# EAGLE board EMC02 (EAGLE 7.2.0)
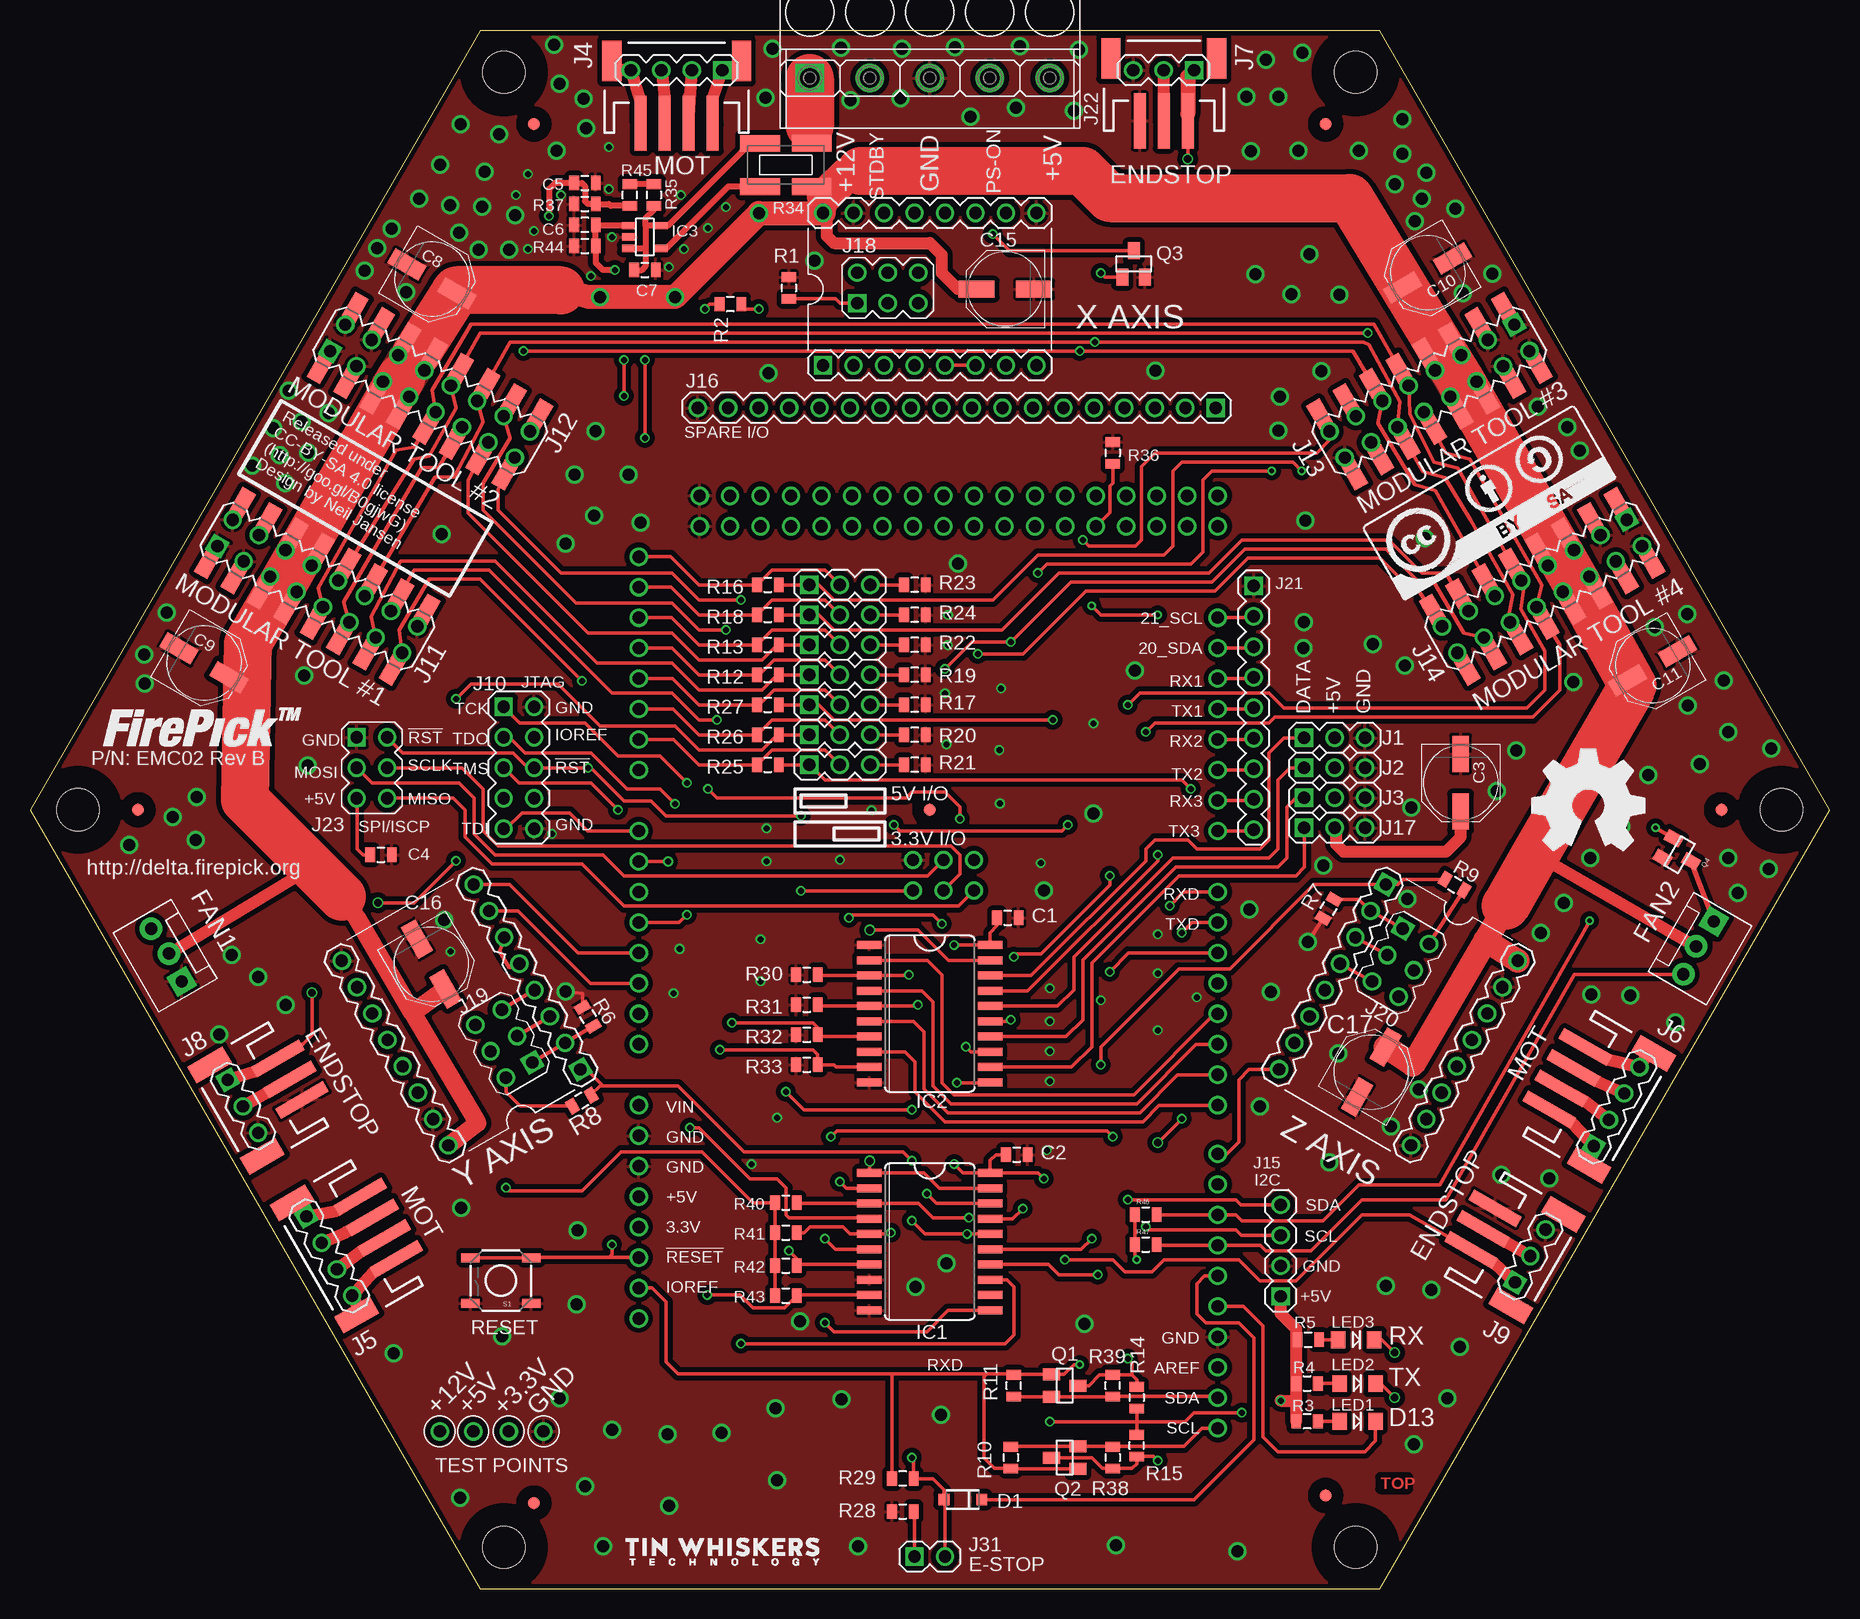
[diagram p2: board, top side]
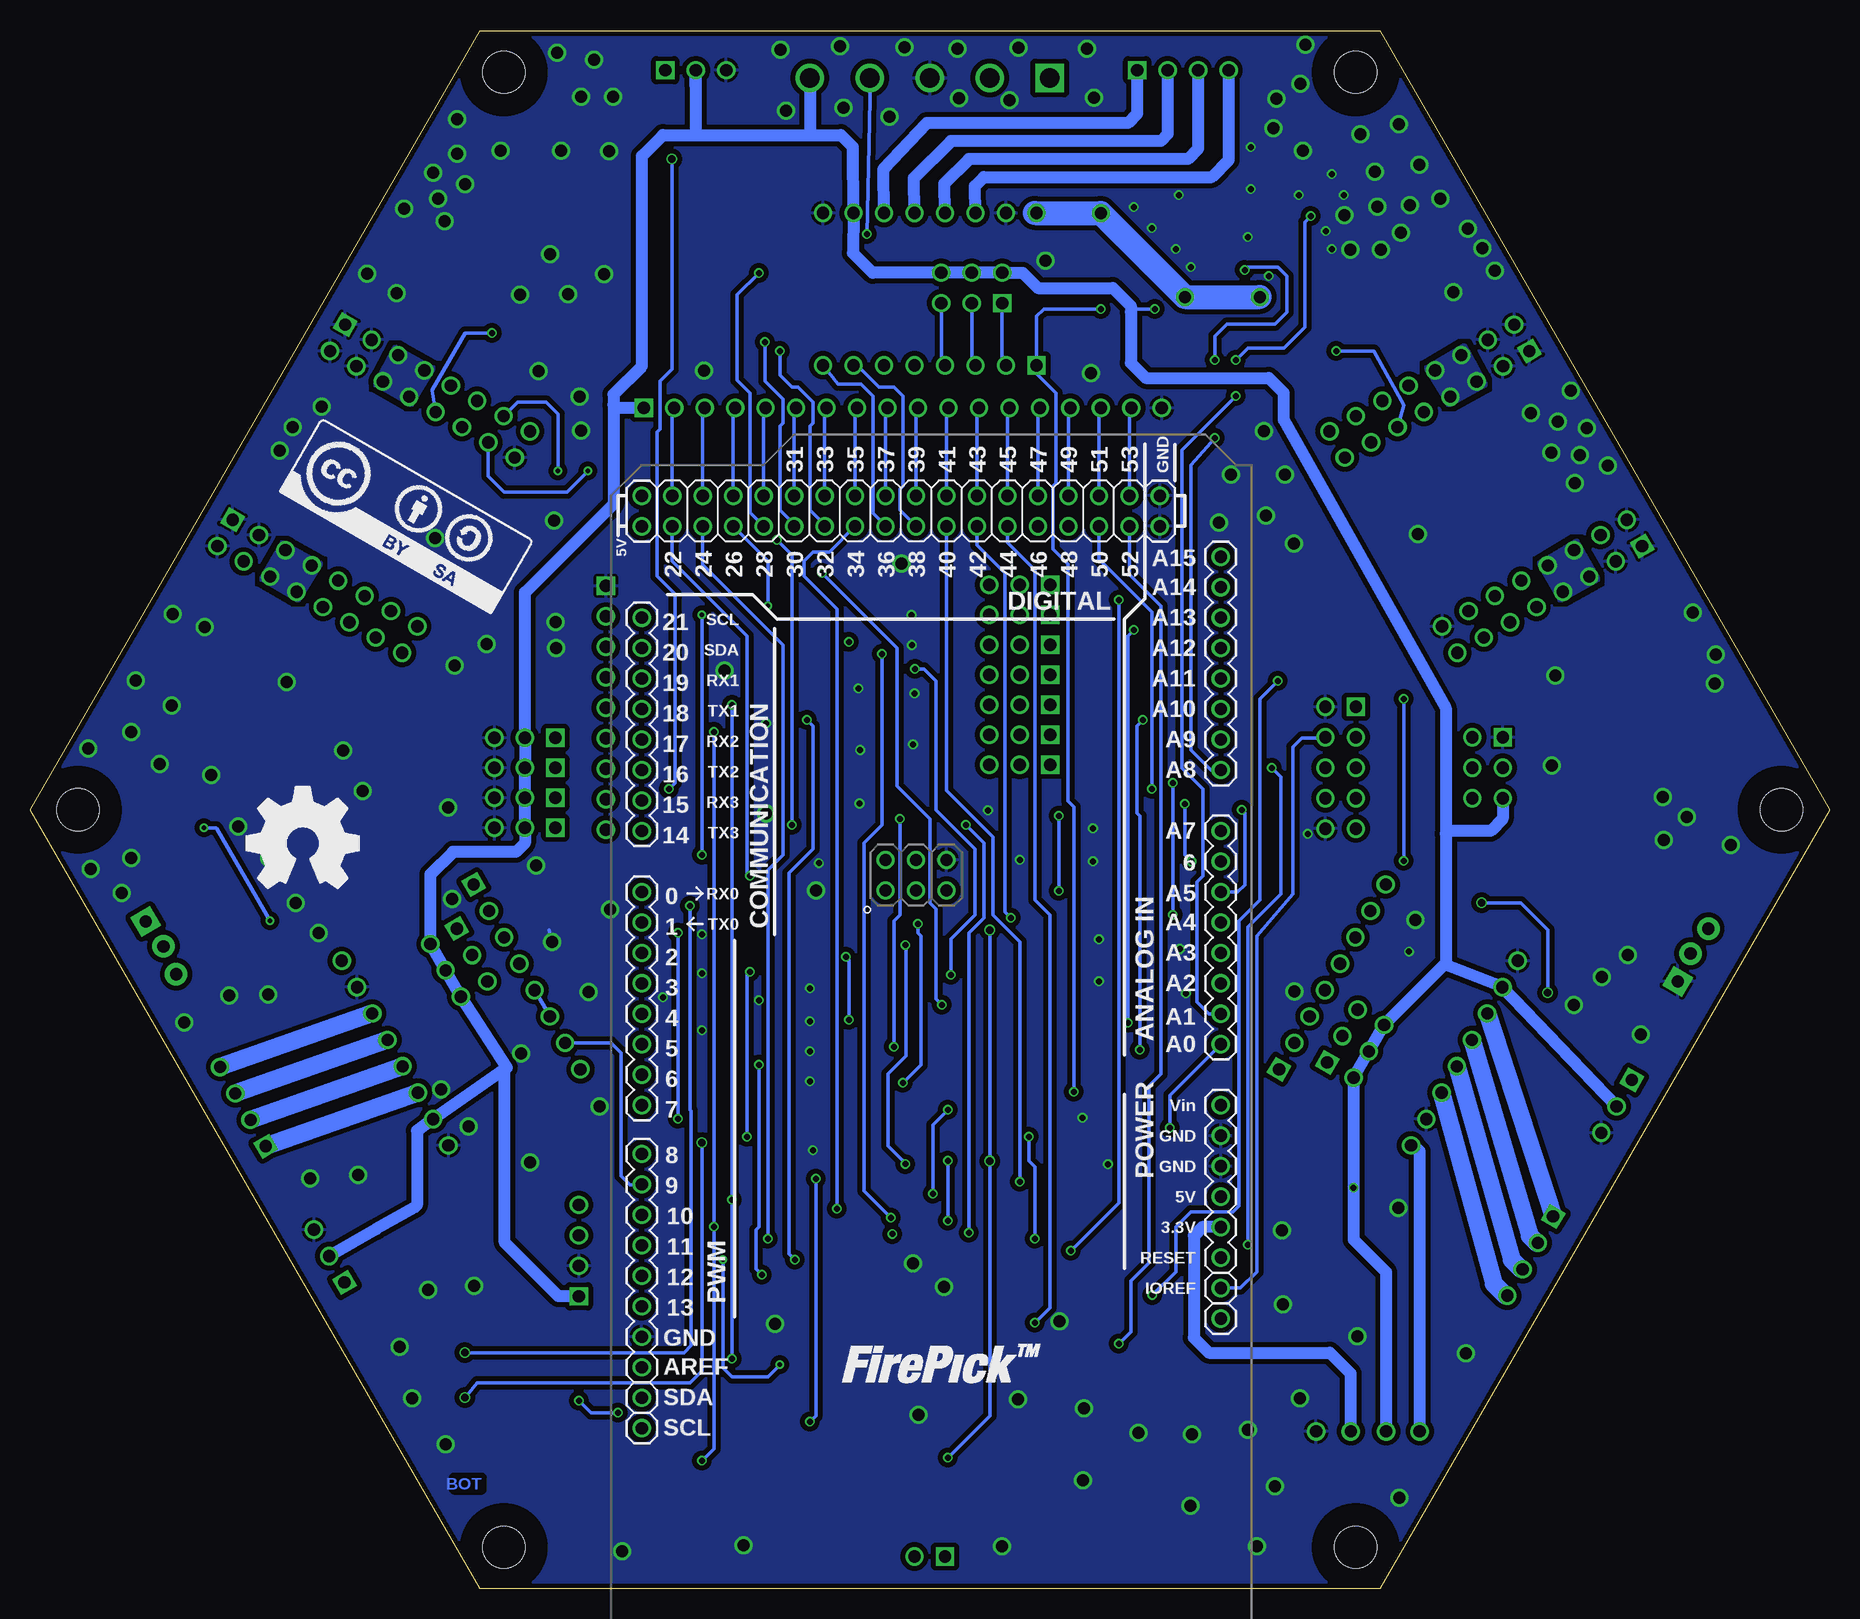
[diagram p3: board, bottom side, seen from below]

Size 150 x 129.9 mm. Coordinates in mm from the lower left corner, seen from the top.
Outline: 37.5,0 112.5,0 150,64.95 112.5,129.9 37.5,129.9 0,64.95 37.5,0
Copper layers (1*16): Top 0.035mm / dielectric 1.5mm / Bottom 0.035mm
Design rules "SeeedStudio_2layer_DRU_no_angle_20140221": minimum track width 6mil, minimum drill 12mil, track to track 6mil, track to pad 6mil, pad to pad 6mil, via to via 6mil, smd to smd 0mil, copper to edge 10mil, drill to drill 10mil, minimum pad ring 10mil, minimum via ring 6mil, stop-mask expansion 2mil, vias tented up to drill 100mil, thermal gap 10mil
Net classes: 0 default: width 0.152 mm, drill 0.305 mm, clearance 0.152 mm
Holes 3.5 mm at 4,64.95 39.5,3.46 110.5,3.46 146,64.95 39.5,126.44 110.5,126.44
tRestrict: area 142.8,61.7 to 149.2,68.2; area 0.8,61.7 to 7.2,68.2; area 107.2,0.2 to 113.8,6.7; area 36.2,123.2 to 42.8,129.7; area 107.2,123.2 to 113.8,129.7; area 36.2,0.2 to 42.8,6.7
bRestrict: area 0.8,61.7 to 7.2,68.2; area 107.2,123.2 to 113.8,129.7; area 142.8,61.7 to 149.2,68.2; area 36.2,0.2 to 42.8,6.7; area 107.2,0.2 to 113.8,6.7; area 36.2,123.2 to 42.8,129.7

## Footprints (pad centres in the part's own frame; a part is rotated, then mirrored left to right if it is on the bottom)
ARDUINO-MEGA = drill 1.016: 0 63.5,50.8; 1 60.96,50.8; 2 58.42,50.8; 3 55.88,50.8; 3.3V 35.56,2.54; 4 53.34,50.8; 5 50.8,50.8; 5V@0 38.1,2.54; 5V@1 93.98,50.8; 5V@2 96.52,50.8; 6 48.26,50.8; 7 45.72,50.8; 8 41.656,50.8; 9 39.116,50.8; 10 36.576,50.8; 11 34.036,50.8; 12 31.496,50.8; 13 28.956,50.8; 14 68.58,50.8; 15 71.12,50.8; 16 73.66,50.8; 17 76.2,50.8; 18 78.74,50.8; 19 81.28,50.8; 20 83.82,50.8; 21 86.36,50.8; 22 93.98,48.26; 23 96.52,48.26; 24 93.98,45.72; 25 96.52,45.72; 26 93.98,43.18; 27 96.52,43.18; 28 93.98,40.64; 29 96.52,40.64; 30 93.98,38.1; 31 96.52,38.1; 32 93.98,35.56; 33 96.52,35.56; 34 93.98,33.02; 35 96.52,33.02; 36 93.98,30.48; 37 96.52,30.48; 38 93.98,27.94; 39 96.52,27.94; 40 93.98,25.4; 41 96.52,25.4; 42 93.98,22.86; 43 96.52,22.86; 44 93.98,20.32; 45 96.52,20.32; 46 93.98,17.78; 47 96.52,17.78; 48 93.98,15.24; 49 96.52,15.24; 50 93.98,12.7; 51 96.52,12.7; 52 93.98,10.16; 53 96.52,10.16; A0 50.8,2.54; A1 53.34,2.54; A2 55.88,2.54; A3 58.42,2.54; A4 60.96,2.54; A5 63.5,2.54; A6 66.04,2.54; A7 68.58,2.54; A8 73.66,2.54; A9 76.2,2.54; A10 78.74,2.54; A11 81.28,2.54; A12 83.82,2.54; A13 86.36,2.54; A14 88.9,2.54; A15 91.44,2.54; AREF 23.876,50.8; GND@0 40.64,2.54; GND@1 43.18,2.54; GND@2 93.98,7.62; GND@3 96.52,7.62; GND@4 26.416,50.8; ICSP-GND 66.167,25.4; ICSP-MISO 63.627,30.48; ICSP-MOSI 66.167,27.94; ICSP-RESET 63.627,25.4; ICSP-SCK 63.627,27.94; IOREF 30.48,2.54; ISCP-+5V 66.167,30.48; N/A 27.94,2.54; RESET 33.02,2.54; SCL 18.796,50.8; SDA 21.336,50.8; VIN 45.72,2.54
0805 = smd 0.8 x 1.2: 1 -0.9,0; 2 0.9,0
PANASONIC_D = smd 3 x 1.4: + 2.4,0; - -2.4,0
SOD-123 = smd 0.9 x 0.95: A 1.575,0; C -1.575,0
MOLEX-1X3_LOCK = drill 1.016 pad 1.88 square: 1 0,0.127 | drill 1.016 pad 1.88: 2 2.54,-0.127; 3 5.08,0.127
FIDUCIAL = smd 1 x 1: 1 0,0
SO20W = smd 0.66 x 2.032: 1 -5.715,-5.029; 2 -4.445,-5.029; 3 -3.175,-5.029; 4 -1.905,-5.029; 5 -0.635,-5.029; 6 0.635,-5.029; 7 1.905,-5.029; 8 3.175,-5.029; 9 4.445,-5.029; 10 5.715,-5.029; 11 5.715,5.029; 12 4.445,5.029; 13 3.175,5.029; 14 1.905,5.029; 15 0.635,5.029; 16 -0.635,5.029; 17 -1.905,5.029; 18 -3.175,5.029; 19 -4.445,5.029; 20 -5.715,5.029
SOT23-5 = smd 0.6 x 1.2: 1 -0.95,-1.306; 2 0,-1.306; 3 0.95,-1.306; 4 0.95,1.306; 5 -0.95,1.306
MA03-1 = drill 1.016 square: 1 -2.54,0 | drill 1.016: 2 0,0; 3 2.54,0
MA04-1 = drill 1.016 square: 1 -3.81,0 | drill 1.016: 2 -1.27,0; 3 1.27,0; 4 3.81,0
CONN-JST-PH_2.0MM_4PIN-SMT-RA = smd 1 x 4.6: 1 3,-2.43; 2 1,-2.43; 3 -1,-2.43; 4 -3,-2.43 | smd 1.6 x 3.4: NC1 -5.4,2.77; NC2 5.4,2.77
CONN-JST_PH-2.0MM-3PIN-SMT-RA = smd 1 x 4.6: 1 2.01,-2.23; 2 0.01,-2.23; 3 -1.99,-2.23 | smd 1.6 x 3.4: NC1 -4.39,2.97; NC2 4.41,2.97
MA05-2 = drill 1.016 square: 1 -5.08,-1.27 | drill 1.016: 2 -5.08,1.27; 3 -2.54,-1.27; 4 -2.54,1.27; 5 0,-1.27; 6 0,1.27; 7 2.54,-1.27; 8 2.54,1.27; 9 5.08,-1.27; 10 5.08,1.27
CONN-RECT-2.54MM-16PIN-2ROW-SMTH = drill 1.016 square: 1 -8.89,-1.27 | drill 1.016: 2 -8.89,1.27; 3 -6.35,-1.27; 4 -6.35,1.27; 5 -3.81,-1.27; 6 -3.81,1.27; 7 -1.27,-1.27; 8 -1.27,1.27; 9 1.27,-1.27; 10 1.27,1.27; 11 3.81,-1.27; 12 3.81,1.27; 13 6.35,-1.27; 14 6.35,1.27; 15 8.89,-1.27; 16 8.89,1.27 | smd 1.27 x 2.3: P1 -8.89,-2.93; P2 -8.89,2.93; P3 -6.35,-2.93; P4 -6.35,2.93; P5 -3.81,-2.93; P6 -3.81,2.93; P7 -1.27,-2.93; P8 -1.27,2.93; P9 1.27,-2.93; P10 1.27,2.93; P11 3.81,-2.93; P12 3.81,2.93; P13 6.35,-2.93; P14 6.35,2.93; P15 8.89,-2.93; P16 8.89,2.93
MA18-1 = drill 1.016 square: 1 -21.59,0 | drill 1.016: 2 -19.05,0; 3 -16.51,0; 4 -13.97,0; 5 -11.43,0; 6 -8.89,0; 7 -6.35,0; 8 -3.81,0; 9 -1.27,0; 10 1.27,0; 11 3.81,0; 12 6.35,0; 13 8.89,0; 14 11.43,0; 15 13.97,0; 16 16.51,0; 17 19.05,0; 18 21.59,0
MA03-2 = drill 1.016 square: 1 -2.54,-1.27 | drill 1.016: 2 -2.54,1.27; 3 0,-1.27; 4 0,1.27; 5 2.54,-1.27; 6 2.54,1.27
MA09-1 = drill 1.016 square: 1 -10.16,0 | drill 1.016: 2 -7.62,0; 3 -5.08,0; 4 -2.54,0; 5 0,0; 6 2.54,0; 7 5.08,0; 8 7.62,0; 9 10.16,0
CONN-OSTOP050000 = drill 1.6 square: 1 -10,0 | drill 1.6: 2 -5,0; 3 0,0; 4 5,0; 5 10,0
MA02-1 = drill 1.016 square: 1 -1.27,0 | drill 1.016: 2 1.27,0
LED-1206-NO_SILK = smd 1.2 x 1.4: A -1.5,0; C 1.5,0
SOT23 = smd 1 x 1.4: 1 -0.95,-1.1; 2 0.95,-1.1; 3 0,1.1
CHIP-1224-KELVIN = smd 1.4 x 3.3: I1 -1.8,-2.15; I2 1.8,-2.15; V1 -1.8,2.15; V2 1.8,2.15
TACTILE_SWITCH_SMD = smd 1.524 x 0.762: 1 -2.54,1.905; 2 2.54,1.905; 3 -2.54,-1.905; 4 2.54,-1.905
STEPSTICK = drill 1.016: 1A 6.35,-1.27; 1B 6.35,-3.81; 2A 6.35,1.27; 2B 6.35,3.81; !RESET! -6.35,-1.27; !SLEEP! -6.35,-3.81; DIR -6.35,-8.89; GND 6.35,6.35; GND@2 6.35,-8.89; MS1 -6.35,6.35; MS2 -6.35,3.81; MS3 -6.35,1.27; STEP -6.35,-6.35; VDD 6.35,-6.35; VMOT 6.35,8.89 | drill 1.016 square: !ENABLE! -6.35,8.89
CON-TESTPOINT = drill 1.016: 1 0,0

## Placement (x,y rotation side)
ARDUINO  ARDUINO-MEGA  [ARDUINO-MEGA]  48.2,-5.4 90 bottom
C1  0.1u  [0805]  81.5,55.95 0 top
C2  0.1u  [0805]  82.25,36.2 0 top
C3  100uF  [PANASONIC_D]  119.25,67.2 270 top
C4  0.1u  [0805]  29.25,61.2 0 top
C5  0.1u  [0805]  46.25,117.2 0 top
C6  0.1u  [0805]  46.25,113.7 180 top
C7  0.1u  [0805]  51.25,109.95 0 top
C8  100uF  [PANASONIC_D]  33.5,109.2 330 top
C9  100uF  [PANASONIC_D]  14.5,77.2 330 top
C10  100uF  [PANASONIC_D]  116.5,109.7 210 top
C11  100uF  [PANASONIC_D]  135.25,76.95 210 top
C15  100uF  [PANASONIC_D]  81.3,108.35 180 top
C16  100uF  [PANASONIC_D]  33.44,52.09 300 top
C17  100uF  [PANASONIC_D]  111.81,43.09 60 top
D1  1N4148  [SOD-123]  77.75,7.45 180 top
FAN1  22232031  [MOLEX-1X3_LOCK]  12.75,50.7 120 top
FAN2  22232031  [MOLEX-1X3_LOCK]  140.25,55.7 240 top
FID1  FIDUCIAL  [FIDUCIAL]  9,64.95 0 top
FID2  FIDUCIAL  [FIDUCIAL]  141,64.95 0 top
FID3  FIDUCIAL  [FIDUCIAL]  42,122.11 0 top
FID4  FIDUCIAL  [FIDUCIAL]  42,7.15 0 top
FID5  FIDUCIAL  [FIDUCIAL]  108,7.79 0 top
FID6  FIDUCIAL  [FIDUCIAL]  75,64.95 0 top
FID7  FIDUCIAL  [FIDUCIAL]  108,122.11 0 top
IC1  74ACT244DW  [SO20W]  75,28.95 270 top
IC2  74ACT244DW  [SO20W]  75,47.95 270 top
IC3  INA168  [SOT23-5]  51.25,112.7 270 top
J1  CONN-0.1-S-1X3  [MA03-1]  108.75,70.95 0 top
J2  CONN-0.1-S-1X3  [MA03-1]  108.75,68.45 0 top
J3  CONN-0.1-S-1X3  [MA03-1]  108.75,65.95 0 top
J4  CONN-0.1-RA-1X4  [MA04-1]  53.9,126.6 180 top
J4A  MOT-X  [CONN-JST-PH_2.0MM_4PIN-SMT-RA]  53.9,124.6 0 top
J5  CONN-0.1-RA-1X4  [MA04-1]  24.94,27.75 300 top
J5A  MOT-Y  [CONN-JST-PH_2.0MM_4PIN-SMT-RA]  26.94,28.9 120 top
J6  CONN-0.1-RA-1X4  [MA04-1]  132.25,40.21 60 top
J6A  MOT-Z  [CONN-JST-PH_2.0MM_4PIN-SMT-RA]  130.26,41.36 240 top
J7  CONN-0.1-RA-1X3  [MA03-1]  94.5,126.6 180 top
J7A  CONN-RECT-3PINJST_PH_2MM  [CONN-JST_PH-2.0MM-3PIN-SMT-RA]  94.5,124.6 0 top
J8  CONN-0.1-RA-1X3  [MA03-1]  17.75,40.23 300 top
J8A  CONN-RECT-3PINJST_PH_2MM  [CONN-JST_PH-2.0MM-3PIN-SMT-RA]  19.74,41.36 120 top
J9  CONN-0.1-RA-1X3  [MA03-1]  125.06,27.75 60 top
J9A  CONN-RECT-3PINJST_PH_2MM  [CONN-JST_PH-2.0MM-3PIN-SMT-RA]  123.06,28.9 240 top
J10  [MA05-2]  40.75,68.45 270 top
J11  CONN-RECT-16PIN-2ROW  [CONN-RECT-2.54MM-16PIN-2ROW-SMTH]  23.95,83.58 330 top
J12  CONN-RECT-16PIN-2ROW  [CONN-RECT-2.54MM-16PIN-2ROW-SMTH]  33.34,99.84 330 top
J13  CONN-RECT-16PIN-2ROW  [CONN-RECT-2.54MM-16PIN-2ROW-SMTH]  116.66,99.84 210 top
J14  CONN-RECT-16PIN-2ROW  [CONN-RECT-2.54MM-16PIN-2ROW-SMTH]  126.05,83.58 210 top
J15  DNP  [MA04-1]  104.25,28.2 90 top
J16  CONN-0.1-S-1x18  [MA18-1]  77.25,98.45 180 top
J17  CONN-0.1-S-1X3  [MA03-1]  108.75,63.45 0 top
J18  CONN-0.1-S-2X3  [MA03-2]  71.5,108.45 0 top
J19  CONN-0.1-S-2X3  [MA03-2]  39.5,45.45 120 top
J20  CONN-0.1-S-2X3  [MA03-2]  114.25,52.2 240 top
J21  [MA09-1]  102,73.45 270 top
J22  OSTOP050000  [CONN-OSTOP050000]  75,125.95 0 top
J22A  OSTTH050160  [CONN-OSTTH050160]  75,125.95 0 top
J23  ICSP/SPI  [MA03-2]  28.5,68.45 270 top
J24  CONN-0.1-S-1X3  [MA03-1]  67.5,78.7 0 top
J25  CONN-0.1-S-1X3  [MA03-1]  67.5,83.7 0 top
J26  CONN-0.1-S-1X3  [MA03-1]  67.5,81.2 0 top
J27  CONN-0.1-S-1X3  [MA03-1]  67.5,73.7 0 top
J28  CONN-0.1-S-1X3  [MA03-1]  67.5,76.2 0 top
J29  CONN-0.1-S-1X3  [MA03-1]  67.5,71.2 0 top
J30  CONN-0.1-S-1X3  [MA03-1]  67.5,68.7 0 top
J31  CONN-0.1-S-1X2  [MA02-1]  75,2.7 0 top
LED1  AMBER  [LED-1206-NO_SILK]  110.65,13.98 0 top
LED2  AMBER  [LED-1206-NO_SILK]  110.65,17.13 0 top
LED3  AMBER  [LED-1206-NO_SILK]  110.55,20.78 0 top
LOGO1  LOGO-FIREPICKLARGE  [LOGO-FIREPICK]  82.5,15.45 0 bottom
LOGO2  LOGO-OSHWMEDIUM  [LOGO-OSHW-MEDIUM]  127.25,62.2 0 bottom
LOGO3  LOGO-CC-BY-SALARGE  [LOGO-CC-BY-SA]  129.25,91.45 330 bottom
LOGO4  LOGO-FIREPICKLARGE  [LOGO-FIREPICK]  5.9,68.5 0 top
LOGO5  LOGO-OSHWMEDIUM  [LOGO-OSHW-MEDIUM]  129.9,65.35 0 top
LOGO6  LOGO-CC-BY-SALARGE  [LOGO-CC-BY-SA]  114.55,82.38 30 top
Q1  BSS138  [SOT23]  86.25,16.95 270 top
Q2  BSS138  [SOT23]  86.25,10.95 90 top
Q3  BSS138  [SOT23]  92,110.45 0 top
Q4  BSS138  [SOT23]  137.5,61.2 240 top
R1  100K  [0805]  63.25,108.45 270 top
R2  10K  [0805]  58.38,107.1 180 top
R3  1k  [0805]  106.45,13.98 180 top
R4  1k  [0805]  106.45,17.13 0 top
R5  1k  [0805]  106.55,20.78 0 top
R6  100K  [0805]  46.5,47.7 300 top
R7  100K  [0805]  108.25,56.7 60 top
R8  10K  [0805]  46,40.7 210 top
R9  10K  [0805]  118.75,58.7 330 top
R10  4.7K  [0805]  81.75,10.95 270 top
R11  4.7K  [0805]  82,16.95 90 top
R12  10K  [0805]  61.5,76.2 0 top
R13  10K  [0805]  61.5,78.7 0 top
R14  4.7K  [0805]  92.25,15.95 270 top
R15  4.7K  [0805]  92.25,11.95 90 top
R16  10K  [0805]  61.5,83.7 0 top
R17  20K  [0805]  73.75,73.7 180 top
R18  10K  [0805]  61.5,81.2 0 top
R19  20K  [0805]  73.75,76.2 180 top
R20  20K  [0805]  73.75,71.2 180 top
R21  20K  [0805]  73.75,68.7 180 top
R22  20K  [0805]  73.75,78.7 180 top
R23  20K  [0805]  73.75,83.7 180 top
R24  20K  [0805]  73.75,81.2 180 top
R25  10K  [0805]  61.5,68.7 0 top
R26  10K  [0805]  61.5,71.2 0 top
R27  10K  [0805]  61.5,73.7 0 top
R28  4.7K  [0805]  72.75,6.45 0 top
R29  100K  [0805]  72.75,9.2 180 top
R30  10K  [0805]  64.75,51.2 0 top
R31  10K  [0805]  64.75,48.7 0 top
R32  10K  [0805]  64.75,46.2 0 top
R33  10K  [0805]  64.75,43.7 0 top
R34  1.0 mOhm  [CHIP-1224-KELVIN]  63,118.7 270 top
R35  4.7K 0.1%  [0805]  52,116.2 270 top
R36  10K  [0805]  90.25,94.7 270 top
R37  4.7k 0.1%  [0805]  46.25,115.45 0 top
R38  DNP  [0805]  90.25,10.95 270 top
R39  DNP  [0805]  90.25,16.95 90 top
R40  10K  [0805]  63,32.2 0 top
R41  10K  [0805]  63,29.7 0 top
R42  10K  [0805]  63,26.95 0 top
R43  10K  [0805]  63,24.45 0 top
R44  100K  [0805]  46.25,111.95 0 top
R45  10k 0.1%  [0805]  50,116.2 90 top
R46  10K  [0805]  93,31.2 0 top
R47  10K  [0805]  93,28.7 0 top
S1  [TACTILE_SWITCH_SMD]  39.25,25.7 180 top
STEPSTICK1  STEPSTICK  [STEPSTICK]  75,108.35 90 top
STEPSTICK2  STEPSTICK  [STEPSTICK]  35.94,47.84 210 top
STEPSTICK3  STEPSTICK  [STEPSTICK]  114.06,47.84 330 top
TP2  +12V  [CON-TESTPOINT]  34.16,13.13 0 top
TP3  GND  [CON-TESTPOINT]  42.79,13.13 0 top
TP4  +5V  [CON-TESTPOINT]  36.96,13.13 0 top
TP5  +3.3V  [CON-TESTPOINT]  39.91,13.13 0 top
U$25  TIN-WHISKERSTSTOP  [TIN-WHISKERS-TSTOP]  50,1.45 0 top

## Tracks (layer width: path | path; a pad name or v marks a point on that pad's centre or on a via)
3.3V
  Bottom 1: TP5.1 39.91,17.95 41.66,19.7 51.75,19.7 53,20.95 53,29.45 52.29,30.16 ARDUINO.3.3V
12V  (via drill 1)
  Top 0.3: J11.8 21.57,85.08 20.75,83.28 | 37.25,38.95 37.25,38.91 37.31,38.84 | C8.+ 35.41,108 35.39,108.02
  Top 1: C15.+ 77.35,108.35 76,109.7 76,111.2 75,112.2 67,112.2 66.41,112.79 66.41,114.2 66.16,114.45 | FAN1.2 23.5,60.2 | FAN2.2 125.48,61.25 | 65.5,116.45 65.5,116.55 | 65.5,116.55 R34.V2 65.25,116.8 65.25,115.95 | 66.45,116.9 65.85,116.9 65.5,116.55 | 65.75,114.45 66.16,114.45 | 66.16,114.45 STEPSTICK1.VMOT | C9.+ 18.11,76.94 | C11.+ 133.3,75.87 | C10.+ J13.7
  Top 1.5: STEPSTICK2.VMOT 37.31,38.84 | 37.25,38.95 31.89,48.03 | 31.89,48.03 27.25,55.95 26,57.7 | C16.+ 31.89,48.03
  Top 2: 123,56.95 121.31,54.06 | 121.31,54.06 115.25,43.7 C17.+ | STEPSTICK3.VMOT 121.31,54.06 | 66.45,116.9 67.75,118.2 68.25,118.2 | 68.25,118.2 69.25,118.2 | 68.25,118.2 68.25,117.45 66.41,115.61 STEPSTICK1.VMOT 66.16,114.7 v60.75,114.7 v53.75,107.7 46.57,107.7 44.27,108.25
  Top 4: 30.95,100.98 20.75,83.28 18.15,78.78 18.11,76.94 17.9,65.8 23.5,60.2 26,57.7 | 128.95,83.78 119.15,100.88 110,115.95 90,115.95 87.75,118.2 69.25,118.2 | 129.15,83.38 133.3,75.87 133.6,75.33 125.48,61.25 123,56.95 | 44.27,108.25 35.55,108.25 35.5,108.2 35.39,108.02 32.13,102.87
  Bottom 1: TP2.1 34.16,36.5 STEPSTICK2.VMOT
  Bottom 2: 66.25,114.7 v60.75,114.7 v53.75,107.7 v47.5,107.7
  pour Top (no thermals): 115.55,103.28 119.45,96.58 122.55,98.28 118.65,105.08
  pour Bottom (no thermals): 119.55,103.58 116.35,101.78 118.25,98.68 121.25,100.38
  pour Bottom (no thermals): 128.95,87.28 125.75,85.48 127.65,82.38 130.75,84.18
  pour Bottom (isolate 0.406, no thermals): 19.25,84.18 21.05,87.38 24.25,85.48 22.45,82.38
  pour Bottom (isolate 0.406, no thermals): 28.65,100.38 30.45,103.68 33.65,101.78 31.75,98.68
  pour Top (no thermals): 128.95,87.48 125.75,85.58 127.65,82.48 130.65,84.28
  pour Top (no thermals): 30.75,104.18 28.45,100.38 31.65,98.58 33.85,102.18
  pour Top (no thermals): 21.25,87.58 19.25,84.08 22.35,82.28 24.25,85.78
20_SDA
  Top 0.3: ARDUINO.20 101.89,78.42 J21.3
21_SCL
  Top 0.3: ARDUINO.21 101.89,80.96 J21.2
!PS_ON  (via drill 0.5)
  Top 0.3: Q3.3 81.65,111.55 v80.25,112.95
  Bottom 0.3: J22.4 80,124.2 v80.25,112.95
!PS_ON_BUF  (via drill 0.5)
  Top 0.3: Q3.1 89.6,109.35 v89.25,109.7 | ARDUINO.28 90,89.74 90,91.95 90.25,92.2 R36.2
  Bottom 0.3: ARDUINO.28 90,89.74 90,99.7 91.05,100.75 91.05,107.9 v89.25,109.7
!RESET  (via drill 0.5)
  Top 0.3: S1.4 S1.3 41.81,27.62 48.25,27.62 | 48.25,27.62 ARDUINO.RESET 49.58,27.62 | J23.2 31.06,69.7 40.25,69.7 41.5,68.45 J10.6 v46.5,68.45 46.75,68.45 49.5,65.7 51.75,65.7 53,64.45 v64.25,64.45 | v64.25,58.2 73.57,58.2 ARDUINO.ICSP-RESET | v48.5,28.7 48.5,27.87 48.25,27.62
  Bottom 0.3: v48.5,28.7 48.5,55.2 45.75,57.95 45.75,67.7 v46.5,68.45 | v64.25,64.45 v64.25,58.2
!TOOL1_EN_BUF  (via drill 0.5)
  Top 0.3: IC1.11 76.53,23.24 74.75,21.45 67,21.45 v66.25,22.2
  Bottom 0.3: ARDUINO.44 68.52,87.22 66.25,84.95 66.25,57.45 65,56.2 65,23.45 v66.25,22.2
!TOOL1_ENABLE  (via drill 0.5)
  Top 0.3: J11.15 30.75,79.95 33.25,84.2 37.5,84.2 v46,75.7 | IC1.9 63.95,24.51 R43.2 62.9,23.45 60.25,23.45 59.2,24.51 v56.45,24.51
  Bottom 0.3: v56.45,24.51 54.5,26.45 54.5,30.2 53.25,31.45 49.75,31.45 49.25,31.95 49.25,55.7 47.5,57.45 47.5,74.2 v46,75.7
!TOOL2_EN_BUF  (via drill 0.5)
  Top 0.3: v59.25,20.45 81.25,20.45 82,21.2 82,25.2 81.42,25.78 IC1.13
  Bottom 0.3: ARDUINO.52 58.36,84.56 55.75,81.95 55.75,42.95 56.75,41.95 56.75,27.2 58.25,25.7 58.25,21.45 v59.25,20.45
!TOOL2_ENABLE  (via drill 0.5)
  Top 0.3: J12.15 39,91.7 39,89.95 44.25,84.7 53.5,84.7 55.75,82.45 v59.25,82.45 | IC1.7 63.99,27.05 R42.2 63.9,27.55 v63.25,28.2
  Bottom 0.3: v59.25,82.45 59.25,32.2 v63.25,28.2
!TOOL3_EN_BUF  (via drill 0.5)
  Top 0.3: IC1.15 87.61,28.32 v88.5,29.2
  Bottom 0.3: ARDUINO.24 93.92,85.37 87.25,78.7 87.25,61.2 88.5,59.95 v88.5,29.2
!TOOL3_ENABLE  (via drill 0.5)
  Top 0.3: J13.15 108.32,95.77 107.25,94.7 93.75,94.7 92.62,93.58 92.62,87.45 92.12,86.95 88.25,86.95 v87.75,87.45 | v71.75,29.7 71.64,29.59 IC1.5 68.36,29.59 67.75,30.2 65,30.2 64.5,29.7 R41.2 | v86.5,63.7 86,63.2 72.5,63.2 v72,63.7
  Bottom 0.3: v87.75,87.45 86.5,86.2 v86.5,63.7 | v71.75,29.7 71.75,54.7 70.5,55.95 70.5,62.2 v72,63.7
!TOOL4_EN_BUF  (via drill 0.5)
  Top 0.3: IC1.17 81.91,30.86 v82.75,31.7
  Bottom 0.3: v82.75,31.7 82.75,81.7 85.5,84.45 85.5,85.7 84.75,86.45 83.35,86.45 ARDUINO.34
!TOOL4_ENABLE  (via drill 0.5)
  Top 0.3: J14.15 115.75,83.2 115.25,83.2 112.5,85.95 101.5,85.95 98.75,83.2 88,83.2 82.75,77.95 v79,77.95 | v78.25,30.95 75.25,30.95 74.08,32.13 IC1.3 63.98,32.13 R40.2
  Bottom 0.3: v79,77.95 79,63.7 80.5,62.2 80.5,33.2 v78.25,30.95
!X_ENABLE  (via drill 0.5)
  Top 0.3: IC1.18 75.58,32.13 v74.75,32.95 | v73.5,39.95 64.5,39.95 v63,41.45 | 59.15,107.3 R2.1 59.67,106.7 v60.75,106.7
  Bottom 0.3: v63,41.45 63,65.2 63.5,65.7 63.5,85.45 64.75,86.7 64.75,91.95 64.5,92.2 64.5,99.7 66.11,101.31 STEPSTICK1.!ENABLE! 66.11,106.09 65.5,106.7 v60.75,106.7 | v74.75,32.95 74.75,38.7 v73.5,39.95
!X_ENABLE_BUF  (via drill 0.5)
  Top 0.3: IC1.2 68.06,33.4 v67.5,33.95
  Bottom 0.3: ARDUINO.40 73.6,66.55 69.75,62.7 69.75,56.2 67.5,53.95 v67.5,33.95
!Y_ENABLE  (via drill 0.5)
  Top 0.3: 47.75,41.95 47.5,41.95 46.78,41.23 R8.1 | 47.75,41.95 54,41.95 59.5,36.45 72.75,36.45 v73.5,35.7 | IC1.16 v78.11,29.59 74.61,29.59 v73.5,30.7 | STEPSTICK2.!ENABLE! 46.38,43.32 47.75,41.95
  Bottom 0.3: v73.5,30.7 v73.5,35.7
!Y_ENABLE_BUF  (via drill 0.5)
  Top 0.3: v55,38.45 55.75,38.45 60,34.2 62.25,34.2 63,33.45 63,31.2 63.25,30.95 69.88,30.95 IC1.4
  Bottom 0.3: v55,38.45 55,41.15 ARDUINO.A0
!Z_ENABLE  (via drill 0.5)
  Top 0.3: v89,26.2 85.75,26.2 84.91,27.05 IC1.14 | R9.1 114.45,59.15 114.01,58.72 STEPSTICK3.!ENABLE! 107.01,58.72 100,51.7 95.75,51.7 89.25,45.2 v89.25,43.7
  Bottom 0.3: v89.25,43.7 89.25,30.2 89.5,29.95 89.5,26.7 v89,26.2
!Z_ENABLE_BUF  (via drill 0.5)
  Top 0.3: ARDUINO.2 91.57,53.02 v90,51.45 | IC1.6 67.14,28.32 v66.25,29.2 | v66.75,37.7 67.25,38.2 89.75,38.2 v90.25,37.7
  Bottom 0.3: v66.25,29.2 66.25,35.2 66.75,35.7 v66.75,37.7 | v90.25,37.7 90.25,51.2 v90,51.45
+5V  (via drill 0.5)
  Top 0.3: J20.2 R9.2 | v77.03,53.67 IC2.20 80,53.7 80,54.7 80.6,55.3 C1.1 | 92.25,13.95 R14.2 | R15.2 92.25,13.95 | 92.25,13.95 96.25,13.95 97,14.7 v101,14.7 | R5.1 105.62,20.78 105.55,20.7 | IC1.20 84.03,34.67 v84.5,34.2 | v85,13.95 92.25,13.95 | IC1.20 80,34.7 77.76,34.7 v77.03,35.42 77.03,35.49 77,35.45 | C2.1 80.5,36.2 80.03,35.73 IC1.20 | R8.2 40.87,40.25 39.67,41.45 J19.2 | J23.5 27.25,65.89 27.25,61.7 27.75,61.2 C4.1 | R43.1 R42.1 R41.1 R40.1 60.25,32.2 56,36.45 49.25,36.45 46,33.2 39.92,33.2 v39.67,33.45 | R2.2 56.65,107.1 v56.25,106.7
  Top 0.5: 105.5,13.93 R3.2
  Top 1: J9.2 J9A.2 | J8.2 J8A.2 | J7A.2 J7.2 | J17.2 108.88,63.33 108.88,62.08 109.5,61.45 118,61.45 119.25,62.7 C3.+ | J15.1 104.25,22.95 105.55,21.65 105.55,20.7 R4.1 105.55,15.7 | R3.2 105.55,15.7 | v104.25,15.7 105.55,15.7
  Bottom 0.3: v101,14.7 103.25,14.7 v104.25,15.7 | v84.5,34.2 84.5,14.45 v85,13.95 | v77.03,35.42 77.03,35.49 78.5,36.95 78.5,42.95 77,44.45 77,53.63 v77.03,53.67 | v56.25,106.7 58,106.7 58.25,106.45
  Bottom 1: J7.2 | TP4.1 36.96,26.41 39.67,29.12 v39.67,33.45 J19.2 J19.4 J19.6 32.1,52.05 | 110.42,43.34 STEPSTICK3.VDD 117.75,38.2 117.75,31.99 117.92,31.82 J9A.2 J9.2 | 110.42,43.34 110.25,43.45 J20.6 J20.4 J20.2 116.62,59.58 114.75,61.45 109.5,61.45 108.75,62.2 J17.2 J3.2 J2.2 J1.2 108.75,83.07 101.37,90.45 101.37,98.7 | 94.5,125.2 J7.2 | 101.37,98.7 101.37,99.58 99,101.95 99,119.45 97.25,121.2 94.5,121.2 | J8.2 STEPSTICK2.VDD 32.1,52.05 | J15.1 105.94,24.39 110.42,28.87 110.42,43.34 | 32,62.95 32,73.45 45.5,97.45 45.5,99.7 46.75,100.95 57,100.95 58.25,102.2 58.25,106.45 58.25,106.95 59.75,108.45 66,108.45 67.27,109.72 J18.2 J18.4 J18.6 | 32,62.95 32,52.15 32.1,52.05 | J23.5 27.23,64.22 28.25,63.2 31.75,63.2 32,62.95 | 94.5,121.2 84.75,121.2 | 84.75,121.2 82.4,121.2 81.4,120.2 STEPSTICK1.VDD 81.4,111.35 79.77,109.72 J18.6 | J22.5 85,121.45 84.75,121.2 | 94.5,121.2 J7.2 | J16.1 101.12,98.45 101.37,98.7 | J18.6 74.48,109.72 74.5,109.7
AVR_RXD  (via drill 0.5, 0.6)
  Top 0.3: LED3.C 112.67,20.78 v113.75,19.7 | ARDUINO.0 96.15,58.1 v95,56.95
  Bottom 0.3: v95,56.95 95,39.95 94.9,39.85 94.9,20.3 95.5,19.7 v113.75,19.7
AVR_TXD  (via drill 0.5, 0.6)
  Top 0.3: LED2.C 112.58,17.13 v113.75,15.95 | 94.11,37.31 v94,37.2 v96,39.2 | ARDUINO.1 96.86,55.56 v96,54.7
  Bottom 0.3: v113.75,15.95 112.75,17.2 95,17.2 94,18.2 v94,37.2 | v96,54.7 v96,39.2
D13_LED
  Top 0.3: LED1.C 112.15,12.35 111.25,11.45 104,11.45 102.75,12.7 102.75,21.95 101.14,23.56 ARDUINO.13
ESTOP
  Top 0.3: D1.C 97,7.45 102,12.45 102,20.95 100.75,22.2 98,22.2 97.25,22.95 97.25,25.45 97.9,26.1 ARDUINO.12
ESTOP_OE  (via drill 0.5, 0.6)
  Top 0.3: v70,35.67 IC1.1 74.53,34.67 75.81,33.4 IC1.19 | IC2.19 76.56,52.4 74,54.95 70.03,54.95 v70,54.92 | J31.2 76.27,7.36 D1.A 76.17,8.28 75.25,9.2 R29.1 73.65,10.8 v73.5,10.95
  Bottom 0.3: v70,54.92 v70,35.67 70,14.45 v73.5,10.95
FAN2_PWM  (via drill 0.4)
  Top 0.3: Q4.1 v135.5,63.45 | v130,55.7 117.5,33.7 110.75,33.7 107.75,30.7 101,30.7 100.52,31.18 ARDUINO.10 98.98,31.2 R46.2
  Bottom 0.3: v130,55.7 134.43,63.39 134.49,63.45 v135.5,63.45
FAN2_TACH
  Top 0.3: FAN2.3 128.75,51.24 128.72,51.22 118,32.45 111,32.45 106.75,28.2 103,28.2 102.56,28.64 ARDUINO.11 93.96,28.64 R47.2
GND  (via drill 0.5, 1)
  Top 0.3: R7.1 v106.5,53.95 | R6.1 46.05,49.65 v44.62,49.83
  Bottom 0.3: v106.5,53.95 106.75,54.95 | v44.62,49.83 44.5,49.45
  other vias: 115.75,41.63 43.7,128.7 37.7,115.2 64.2,22.3 27.9,109.9 46.35,121.75 28.95,111.75 82.17,123.48 21.55,99.88 16.8,52.85 34.3,87.95 47.75,3.55 122.65,34.5 19,51 39.35,21.05 37.9,118.15 84.5,58.2 75.95,14.5 114.4,119.65 77.1,128.5 61.55,101.35 102.15,109.6 104.05,124.4 119.45,108 103,127.45 101.75,119.85 113.75,117.08 138.18,73.63 106.05,128.05 115.45,114 138.12,81.28 31.35,108.1 105.15,107.93 11.4,81.38 115.35,12.08 24.9,98.03 22.65,97.33 23.2,94.73 34.2,118.73 20.25,96.78 21.25,92.18 45.55,23.73 18.5,93.63 77.35,85.48 20.8,94.53 62.15,15.08 9.55,75.48 11.9,64.35 125.7,98.58 141.18,75.73 128.12,96.85 141.57,71.45 87.9,22.1 35.75,113.05 106.17,80.6 30.3,19.63 9.5,77.88 128.62,75.6 132.65,63.55 134.9,67.85 135.45,80.2 139.18,68.75 144.95,60 80.95,75.08 104.2,99.4 76.53,81.2 142.35,58 127.85,57.2 125.95,54.68 116.8,24.93 92.1,76.58 62.25,9.08 80.8,69.93 53.27,6.95 35.95,31.78 103.45,49.78 67.5,60.78 126.65,34.23 108.3,35.58 76.5,78.68 21.3,48.68 80.85,65.48 35.05,53.13 109.05,44.63 119.2,20.18 13.9,66.03 107.62,101.5 129.2,94.88 111.95,78.78 73.8,25.2 114.6,76.98 22.85,76.15 106.3,89.08 113.45,38.58 13.82,62.45 87.45,128.33 15.75,46.23 8.25,62 145.15,70.05 114.8,57.5 130.15,49.55 133.4,49.48 104.05,96.58 106.15,78.43 47.15,96.5 39.1,121.25 54.15,53.35 116,115.9 67.6,128.45 84.25,60.5 35.9,122.1 32.45,115.9 116.25,87.6 61.3,124.3 82.5,128.6 40.45,114.5 39.95,111.65 72.58,124.25 105.72,119.9 113,25.25 118.8,115.05 72.7,128.4 87,123.2 35.85,7.6 30.15,113.4 49.9,92.9 115.15,65.15 50.9,88.9 45.4,92.9 44.65,87.15 37.4,111.65 43.9,119.9 101.4,124.4 123.9,69.9 109.15,107.9 121.9,109.65 114.4,122.53 93.8,101.55 130.05,60.93 141.55,60.93 44.15,15.9 76.4,27.15 70.15,64.9 60.15,35.4 88.65,72.15 88.65,64.65 61.9,128.4 23.15,68.65 45.65,29.9 118.15,15.9 101.65,56.65 76.4,70.4 53.65,49.65 61.4,63.4 61.4,60.65 60.9,54.15 53.15,12.9 100.65,3.15 47,89.45 44.12,125.45 46.12,124.2 68.38,124.08 78.38,122.7 65.38,110.7 35,115.33 57.62,13 48.5,13.25 137.15,47.23 102.53,40.23 116.4,118.08 110.78,119.9 90.53,3.65 106.65,111.28 76.28,74.65 122.28,66.53 60.9,50.65 62.27,39.28 34.52,55.78 85,50.08 85,47.33 85,44.83 43.5,62.95 107.8,60.3 85,42.33 94,51.33 94,54.58 89.25,49.08 94,46.58 97.25,49.33 48.5,112.7 58,115.2 54.5,111.7 40.5,116.2 53.25,110.2 46.75,109.45 56.5,113.45 54.25,116.2 48.25,116.7 41.5,117.95 48.25,120.2 41.5,111.7 42,113.2 44.25,116.2 84.75,36.58 67.65,15.83 69,3.58 46.25,8.55
  pour Bottom (isolate 0.406, rank 2): 37.5,129.75 0,64.85 37.5,0.05 112.5,-0.1 150,64.95 112.5,129.75
  pour Top (isolate 0.406, rank 2): 37.6,129.75 0.1,64.85 37.6,0.05 112.6,-0.1 149.85,64.95 112.6,129.75
IOREF  (via drill 0.4)
  Top 0.3: Q2.1 81.8,10 R10.2 80.4,10.05 79.5,10.95 79.5,17.7 79.75,17.95 | ARDUINO.IOREF 51.87,25.08 53,23.95 53,18.95 54,17.95 72,17.95 | 72,17.95 79.75,17.95 | 79.75,17.95 81.9,17.95 R11.2 82.05,17.9 Q1.1 86.2,17.9 87,18.7 v87.5,18.7 | R29.2 71.85,17.8 72,17.95 | R46.1 R47.1 92.1,27.6 v92.25,27.45
  Bottom 0.3: ARDUINO.IOREF 49.12,25.08 47.75,26.45 47.75,54.45 44.75,57.95 44.75,70.2 44,70.95 42.06,70.95 J10.4 | v92.25,27.45 92.25,18.45 91.5,17.7 88.5,17.7 v87.5,18.7
ISENSE  (via drill 0.5)
  Top 0.3: v51.25,95.95 v51.25,102.45 | 47.2,113.65 C6.1
  Top 0.5: v48.75,109.95 47.75,109.95 47.15,110.55 R44.2 C6.1 49.89,113.7 IC3.1
  Bottom 0.3: ARDUINO.A8 51.56,68.26 53.25,69.95 53.25,93.7 v51.25,95.95 | v48.75,109.95 48.5,110.2 46,110.2 45.25,109.45 45.25,106.45 46.25,105.45 50.25,105.45 51.25,104.45 v51.25,102.45
MISO
  Top 0.3: J23.6 35.29,65.91 36.25,64.95 36.25,62.7 38.5,60.45 46,60.45 49.5,56.95 77.4,56.95 ARDUINO.ICSP-MISO
MOSI
  Top 0.3: J23.3 27.25,68.45 28.5,67.2 35.75,67.2 37,65.95 37,62.95 38.75,61.2 47.75,61.2 49.5,59.45 74.82,59.45 ARDUINO.ICSP-MOSI
N$1
  Top 0.5: R35.1 R45.2
N$2
  Top 0.4: Q4.3 FAN2.1
N$3
  Top 1: 65,121.95 65,120.65 R34.V1
  Top 4: J22.1 65,121.95
N$4
  Top 0.3: LED1.A R3.1
N$5
  Top 0.3: J31.1 73.73,6.37 R28.2
N$8
  Top 0.3: J24.3 R22.2
N$9
  Top 0.3: R19.2 J28.3
N$10
  Top 0.3: R17.2 J27.3
N$11
  Top 0.3: STEPSTICK1.!SLEEP! STEPSTICK1.!RESET!
N$12
  Top 0.3: R20.2 J29.3
N$13
  Top 0.3: J25.3 R23.2
N$14
  Top 0.3: J26.3 R24.2
N$15
  Top 0.3: R21.2 J30.3
N$16
  Top 0.3: STEPSTICK2.!RESET! 40.75,51.73 39.95,51.83 39.15,53.13 39.45,53.93 STEPSTICK2.!SLEEP!
N$17
  Top 0.5: R34.I1 60.05,120.5 53.2,113.65 IC3.5 51.3,113.65 | 51.3,113.65 51.3,111.7 | 51.3,111.7 51.3,110.25 51,109.95 C7.1 | IC3.3 51.25,111.75 51.3,111.7 | 51.3,113.65 51.3,114.25 52,114.95 R35.2
N$18
  Top 0.5: R34.I2 58.2,116.9 53.05,111.75 IC3.4
N$21
  Top 0.3: R4.2 LED2.A
N$22
  Top 0.3: 107.35,20.78 R5.2 LED3.A
N$24
  Bottom 0.3: STEPSTICK3.!RESET! STEPSTICK3.!SLEEP!
RX1
  Top 0.3: ARDUINO.19 101.89,75.88 J21.4
RX2
  Top 0.3: ARDUINO.17 101.89,70.8 J21.6
RX3
  Top 0.3: ARDUINO.15 101.89,65.72 J21.8
SCL
  Top 0.3: 90.7,11.9 Q2.2 81.8,11.9 R10.1 | 90.7,11.9 R38.1 | 90.7,11.9 96.2,11.9 97.7,13.4 ARDUINO.SCL
SCLK
  Top 0.3: J23.4 36,68.45 37.75,66.7 37.75,63.2 39,61.95 76.75,61.95 77.5,61.2 77.5,59.59 ARDUINO.ICSP-SCK
SDA
  Top 0.3: R11.1 82.05,16 Q1.2 90.2,16 R39.1 98.89,16.05 ARDUINO.SDA
SERVO1
  Top 0.3: J1.1 104.5,70.95 103.25,69.7 103.25,62.45 102.5,61.7 97.25,61.7 96.5,62.45 93.75,62.45 93,61.7 93,60.7 83.42,51.13 IC2.18
SERVO1_BUF
  Top 0.3: ARDUINO.4 98.74,47.94 92,41.2 77,41.2 76,42.2 76,51.2 74.81,52.4 IC2.2
SERVO2
  Top 0.3: J2.1 105,68.45 104,67.45 104,61.7 103.25,60.95 95.25,60.95 87,52.7 87,49.95 85.64,48.59 IC2.16
SERVO2_BUF
  Top 0.3: IC2.4 74.34,49.86 75.25,48.95 75.25,41.95 76.75,40.45 92.25,40.45 97.2,45.4 ARDUINO.5
SERVO3
  Top 0.3: J3.1 105.5,65.95 104.75,65.2 104.75,60.95 104,60.2 95.5,60.2 87.75,52.45 87.75,47.45 86.34,46.05 IC2.14
SERVO3_BUF
  Top 0.3: IC2.6 73.64,47.32 74.5,46.45 74.5,41.7 76.5,39.7 92.5,39.7 95.66,42.86 ARDUINO.6
SERVO4
  Top 0.3: IC2.12 86.81,43.51 88.5,45.2 88.5,52.2 95.75,59.45 105.5,59.45 106.21,60.16 J17.1
SERVO4_BUF
  Top 0.3: IC2.8 72.92,44.78 73.75,43.95 73.75,41.45 76.25,38.95 92.75,38.95 94.12,40.32 ARDUINO.7
SPAREIO_0
  Bottom 0.3: ARDUINO.23 96.46,98.29 J16.2
SPAREIO_1
  Bottom 0.3: ARDUINO.25 93.92,98.29 J16.3
SPAREIO_2
  Bottom 0.3: ARDUINO.27 91.38,98.29 J16.4
SPAREIO_3
  Bottom 0.3: ARDUINO.29 88.84,98.29 J16.5
SPAREIO_4
  Bottom 0.3: ARDUINO.31 86.3,98.29 J16.6
SPAREIO_5
  Bottom 0.3: ARDUINO.33 83.76,98.29 J16.7
SPAREIO_6
  Bottom 0.3: ARDUINO.35 81.22,98.29 J16.8
SPAREIO_7
  Bottom 0.3: ARDUINO.37 78.68,98.29 J16.9
SPAREIO_8
  Bottom 0.3: ARDUINO.39 76.14,98.29 J16.10
SPAREIO_9
  Bottom 0.3: ARDUINO.41 73.6,98.29 J16.11
SPAREIO_10
  Bottom 0.3: ARDUINO.43 71.06,98.29 J16.12
SPAREIO_11
  Bottom 0.3: ARDUINO.45 68.52,98.29 J16.13
SPAREIO_12
  Bottom 0.3: ARDUINO.47 65.98,98.29 J16.14
SPAREIO_13
  Bottom 0.3: ARDUINO.49 63.44,98.29 J16.15
SPAREIO_14
  Bottom 0.3: ARDUINO.51 60.9,98.29 J16.16
SPAREIO_15
  Bottom 0.3: ARDUINO.53 58.36,98.29 J16.17
TCK  (via drill 0.5)
  Top 0.3: v54.75,67.2 52.5,69.45 49,69.45 46.25,72.2 40.81,72.2 J10.1 | ARDUINO.A4 54.11,55.56 v54.75,56.2
  Bottom 0.3: v54.75,67.2 v54.75,56.2
TDI
  Top 0.3: ARDUINO.A7 46.48,63.18 44.96,64.7 41,64.7 39.67,63.37 J10.9
TDO  (via drill 0.5)
  Top 0.3: J10.3 39.96,70.99 41.25,69.7 46.75,69.7 49.75,66.7 52.5,66.7 v53.75,65.45 | ARDUINO.A6 v53.19,60.64
  Bottom 0.3: v53.75,65.45 53.75,61.2 v53.19,60.64
TMS  (via drill 0.5)
  Top 0.3: J10.5 39.5,68.45 40.75,67.2 46.75,67.2 v49,64.95
  Bottom 0.3: ARDUINO.A5 49.35,58.1 48.75,58.7 48.75,64.7 v49,64.95
TOOL1_AIN
  Top 0.3: J11.13 28.45,81.08 30.9,85.68 30.93,85.7 38.75,85.7 47.25,77.2 53.5,77.2 55.75,74.95 61,74.95 62.25,76.2 R12.2 J28.1
TOOL1_AIN_BUF
  Top 0.3: J28.2 66.25,77.45 62,77.45 60.75,76.2 R12.1 55.75,76.2 53.53,78.42 ARDUINO.A12
TOOL1_DOUT  (via drill 0.5)
  Top 0.3: J11.14 32,84.95 38.25,84.95 48.5,74.7 53.5,74.7 55.75,72.45 v57.25,72.45 | v57.5,44.95 65.25,44.95 65.65,44.55 R33.2 67,43.7 67.19,43.51 IC2.9
  Bottom 0.3: v57.25,72.45 57.75,71.95 57.75,64.7 57.5,64.45 v57.5,44.95
TOOL1_DOUT_BUF  (via drill 0.5)
  Top 0.3: v68.25,55.95 68.5,56.2 75.25,56.2 v76,55.45 | v77.25,42.2 79.99,42.2 IC2.11
  Bottom 0.3: ARDUINO.42 71.06,87.01 68.75,84.7 68.75,56.45 v68.25,55.95 | v76,55.45 76,54.7 75.75,54.45 75.75,43.7 v77.25,42.2
TOOL2_AIN
  Top 0.3: J12.13 36.5,92.45 36.5,89.7 46.5,79.7 53.5,79.7 55.75,77.45 61,77.45 62.25,78.7 R13.2 J24.1
TOOL2_AIN_BUF
  Top 0.3: J24.2 66.25,79.95 61.85,79.95 R13.1 55.75,78.7 53.49,80.96 ARDUINO.A13
TOOL2_DOUT  (via drill 0.5)
  Top 0.3: 65.56,46.05 R32.2 65.65,46.8 65.25,47.2 v58.5,47.2 | J12.14 40,95.95 37.75,92.2 37.75,89.95 45.5,82.2 53.5,82.2 55.75,79.95 v58,79.95 | IC2.7 65.56,46.05 | 65.56,46.05 65.75,46.24
  Bottom 0.3: v58.5,47.2 58.5,79.45 v58,79.95
TOOL2_DOUT_BUF  (via drill 0.5)
  Top 0.3: IC2.13 78.42,44.78 v78,45.2 | v56.5,66.7 57.25,65.95 73,65.95 73.5,66.45 76.25,66.45 77.5,65.2 v77.5,64.2
  Bottom 0.3: ARDUINO.50 60.9,85.85 56.5,81.45 v56.5,66.7 | v78,45.2 78,55.7 77.5,56.2 v77.5,64.2
TOOL3_AIN  (via drill 0.4)
  Top 0.3: R16.2 J25.1 65.75,83.7 67,82.45 80.25,82.45 84,86.2 94.5,86.2 95.25,86.95 95.25,93.2 96,93.95 105.25,93.95 v106,93.2
  Bottom 0.3: v106,93.2 106,97.95 107,98.95 109.34,98.95 J13.13
TOOL3_AIN_BUF
  Top 0.3: J25.2 66.25,84.95 61.85,84.95 R16.1 55.75,83.7 53.41,86.04 ARDUINO.A15
TOOL3_DOUT  (via drill 0.4, 0.5)
  Top 0.3: R31.2 65.77,48.59 IC2.5 73.89,48.59 v74,48.7 | v84,84.7 84.75,85.45 96.75,85.45 97.75,86.45 97.75,92.45 98.5,93.2 v103.5,93.2
  Bottom 0.3: v74,48.7 74.5,49.2 74.5,56.7 75,57.2 75,64.2 77.75,66.95 77.75,78.45 v84,84.7 | J13.14 111.79,92.74 110.5,91.45 105.25,91.45 v103.5,93.2
TOOL3_DOUT_BUF  (via drill 0.5)
  Top 0.3: v82,52.7 82.25,52.95 84.25,52.95 90,58.7 v90,59.45 | IC2.15 81.61,47.32 v81.75,47.45
  Bottom 0.3: ARDUINO.22 96.46,85.66 90.25,79.45 90.25,59.7 v90,59.45 | v81.75,47.45 81.75,52.45 v82,52.7
TOOL4_AIN
  Top 0.3: R18.2 J26.1 65.75,81.2 67,79.95 81,79.95 85.75,84.7 98.25,84.7 101,87.45 113.25,87.45 116,84.7 118,84.7 J14.13
TOOL4_AIN_BUF
  Top 0.3: ARDUINO.A14 53.45,83.5 55.75,81.2 R18.1 61.85,82.45 66.25,82.45 J26.2
TOOL4_DOUT  (via drill 0.5)
  Top 0.3: R30.2 65.58,51.13 IC2.3 73.17,51.13 v73.25,51.2 | J14.14 119.5,79.7 117,83.95 115.75,83.95 113,86.7 101.25,86.7 98.5,83.95 86.75,83.95 v81.75,78.95 78.5,78.95 v76.25,76.7
  Bottom 0.3: v73.25,51.2 73.25,54.2 71.25,56.2 71.25,61.7 74.5,64.95 74.5,75.7 75.5,76.7 v76.25,76.7
TOOL4_DOUT_BUF  (via drill 0.4, 0.5)
  Top 0.3: IC2.17 83.16,49.86 94,60.7 v94,61.2 | v94,81.2 89.25,81.2 v88.5,81.95
  Bottom 0.3: v94,61.2 v94,81.2 | v88.5,81.95 88.5,85.7 ARDUINO.26
TOOL_DIR  (via drill 0.5)
  Top 0.3: J11.11 26.15,82.28 32.65,93.48 34.05,93.48 J12.11 | J14.11 119.9,86.69 117.15,91.58 115.45,92.08 112.35,97.18 J13.11 110.25,103.2 v87.5,103.2 v41.12,103.2
  Bottom 0.3: ARDUINO.32 83.76,88.71 85,89.95 85,96.95 84.75,97.2 84.75,98.95 86,100.2 86.5,100.2 87.5,101.2 v87.5,103.2 | v41.12,103.2 38,103.2 35.5,98.7 36,96.95 J12.11
TOOL_SCL  (via drill 0.5)
  Top 0.3: J11.10 32,94.2 33.25,94.45 35.5,98.45 J12.10 37.5,104.7 v111.5,104.7 | J13.10 118,94.7 120,94.2 126,83.7 J14.10 127.5,78.7 127.5,74.95 125.25,72.7 103.75,72.7 103.25,72.2 93.75,72.2 v93,71.45 | Q2.3 88.5,10.95 89.4,10.05 R38.2 91.85,10.05 92.25,10.45 R15.1 93.65,11.05 v94,10.7 | J15.3 100.98,29.47 100.5,29.95 93.25,29.95 v93,30.2
  Bottom 0.3: J13.10 116.5,99.95 113.75,104.7 v111.5,104.7 | v94,10.7 93,11.7 v93,30.2 v93,71.45
TOOL_SDA  (via drill 0.5)
  Top 0.3: J11.9 24,83.45 30.5,94.95 32,95.2 J12.9 33.5,99.95 36.75,105.45 112,105.45 J13.9 115,97.95 117,93.95 119,93.45 J14.9 124.5,83.45 124.25,81.7 126.25,78.2 126.25,74.95 124.75,73.45 104.5,73.45 103.25,74.7 92.5,74.7 v91.5,73.7 | Q1.3 88.25,16.95 89.15,17.85 R39.2 91.85,17.85 | R14.1 92.25,17.45 91.85,17.85 | 91.85,17.85 91.85,18.85 v91.5,19.2 | J15.4 100.94,32.01 100.5,32.45 v91.5,32.45
  Bottom 0.3: v91.5,19.2 v91.5,32.45 v91.5,73.7
TOOL_STEP  (via drill 0.5)
  Top 0.3: J11.12 33.75,92.68 35.35,92.68 37.75,97.28 J12.12 40,103.95 v88.75,103.95 111.12,103.95 111.6,103.73 114.2,98.98 J13.12 116.1,93.13 117.95,92.63 120.04,89.15 123.6,82.88 123.25,81.2 J14.12
  Bottom 0.3: ARDUINO.30 86.3,88.75 87.5,89.95 87.5,96.95 87.25,97.2 87.25,99.2 88.75,100.7 v88.75,103.95
TX1
  Top 0.3: ARDUINO.18 101.89,73.34 J21.5
TX2
  Top 0.3: ARDUINO.16 101.89,68.26 J21.7
TX3
  Top 0.3: ARDUINO.14 101.89,63.18 J21.9
VSENSE  (via drill 0.5)
  Top 0.3: v49.5,99.45 v49.5,102.45
  Top 0.5: v43.25,114.45 43.25,116.7 43.75,117.2 C5.1 46,117.2 46.25,116.95 46.25,115.7 46.5,115.45 R37.2 48.25,115.45 48.4,115.3 R45.1
  Bottom 0.3: ARDUINO.A1 51.74,47.94 52.75,48.95 52.75,58.95 52.25,59.45 52.25,66.7 54,68.45 54,94.95 v49.5,99.45 | v49.5,102.45 48.5,103.45 45.5,103.45 43.75,105.2 43.75,113.95 v43.25,114.45
X1A
  Top 1: 54.9,124.4 J4A.2 J4.2
  Bottom 1: J4.2 55.17,121.28 55.75,120.7 73.25,120.7 76.32,117.63 STEPSTICK1.1A
X1B
  Top 1: J4A.1 56.9,124.3 J4.1 59.2,126.6
  Bottom 1: J4.1 57.71,122.99 58.5,122.2 75.25,122.2 78.86,118.34 STEPSTICK1.1B
X2A
  Top 1: J4A.3 52.9,124.33 J4.3
  Bottom 1: J4.3 52.63,120.07 53.5,119.2 71.75,119.2 73.78,117.17 STEPSTICK1.2A
X2B
  Top 1: J4A.4 50.9,124 J4.4 48.6,126.6
  Bottom 1: STEPSTICK1.2B 71.24,116.94 71.25,116.95 70.5,117.7 51.5,117.7 50.09,119.11 J4.4
X_DIR
  Bottom 0.3: ARDUINO.36 78.68,88.63 79.75,89.7 79.75,99.45 80.75,100.45 82.64,100.45 STEPSTICK1.DIR
X_MIN_PIN
  Top 0.3: J30.2 66.25,69.95 61.85,69.95 R25.1 | 60.58,68.68 R25.1 | ARDUINO.A9 53.65,70.8 55.75,68.7 R25.1
X_MS1
  Top 0.3: J18.1 68.94,107.2 67.5,107.2 67.15,107.55 R1.2
  Bottom 0.3: J18.1 68.96,102.31 STEPSTICK1.MS1
X_MS2
  Bottom 0.3: J18.3 71.5,102.31 STEPSTICK1.MS2
X_MS3
  Bottom 0.3: J18.5 74.04,102.31 STEPSTICK1.MS3
X_STEP
  Bottom 0.3: ARDUINO.38 76.14,88.59 77.5,89.95 77.5,91.7 77.25,91.95 77.25,99.45 78,100.2 79.25,100.2 81.05,102 STEPSTICK1.STEP
X_STOP  (via drill 0.5, 0.6)
  Top 0.3: J7A.1 96.51,119.21 v96.5,119.2 | R25.2 J30.1 65,68.7 66.25,67.45 96,67.45 v96.75,66.7
  Top 1: 96.5,124.5 96.51,122.96 J7A.1
  Top 1.27: J7.1 96.51,126.07 96.51,122.96
  Bottom 0.3: v96.5,119.2 96.5,101.7 97.5,100.7 97.5,96.7 97.75,96.45 97.75,84.45 96.25,82.95 96.25,67.2 v96.75,66.7
Y1A
  Top 1: J5.2 26.35,29.73 J5A.2
  Bottom 1.5: STEPSTICK2.1A 25,29.45 24.39,28.84 J5.2
Y1B
  Top 0.3: 23.05,31.03 J5.1
  Top 1: J5.1 25.55,31.53 J5A.1 | 23.05,31.03 22.45,32.23
  Bottom 0.3: 23.03,31.07 23.03,31.05 J5.1 23.01,31.07 23.01,31.11
  Bottom 1.5: STEPSTICK2.1B J5.1
Y2A
  Top 1: J5.3 27.55,28.13 J5A.3
  Bottom 1.5: STEPSTICK2.2A 26.5,27.45 25.69,26.64 J5.3
Y2B
  Top 0.3: 26.85,24.43 J5.4
  Top 1: J5.4 28.65,26.43 J5A.4 | 26.85,24.43 27.65,22.93
  Bottom 1.5: STEPSTICK2.2B 28,25.45 26.99,24.45 J5.4
Y_DIR
  Top 0.3: STEPSTICK2.DIR 39.99,58.72 45.68,53.02 ARDUINO.A3
Y_MIN_PIN
  Top 0.3: J29.2 66.25,72.45 61.85,72.45 R26.1 | 60.58,71.22 R26.1 | ARDUINO.A10 53.61,73.34 55.75,71.2 R26.1
Y_MS1
  Top 0.3: J19.1 STEPSTICK2.MS1 R6.2
Y_MS2
  Top 0.3: J19.3 STEPSTICK2.MS2
Y_MS3
  Top 0.3: STEPSTICK2.MS3 J19.5
Y_STEP
  Top 0.3: ARDUINO.A2 46.72,50.48 40.69,56.52 STEPSTICK2.STEP
Y_STOP  (via drill 0.5, 0.6)
  Top 0.3: v23.5,49.7 23.5,46.2 22.75,45.45 J8A.1 | v29,57.2 32,57.2 v35.5,60.7 | J29.1 R26.2 62.25,71.2 61,69.95 55.75,69.95 53.75,71.95 47.5,71.95 44,75.45 36.75,75.45 v35.5,74.2
  Top 0.406: J8.1 16.48,42.55
  Top 1: J8.1 18.75,43.13 J8A.1
  Bottom 0.3: v29,57.2 25.75,57.2 23.5,54.95 v23.5,49.7 | v35.5,74.2 v35.5,60.7
Z1A
  Top 1: J6A.2 129.65,40.63 J6.2
  Bottom 1.5: STEPSTICK3.1A J6.2
Z1B
  Top 0.3: J6.1 130.35,36.83
  Top 1: J6A.1 128.55,38.83 J6.1 | 130.35,36.83 129.65,35.43
  Bottom 1.5: STEPSTICK3.1B J6.1
Z2A
  Top 1: J6A.3 130.65,42.33 J6.3
  Bottom 1.5: STEPSTICK3.2A J6.3
Z2B
  Top 0.3: 134.15,43.43 J6.4
  Top 1: J6A.4 131.55,44.13 J6.4 | 134.15,43.43 134.95,44.83
  Bottom 1.5: STEPSTICK3.2B J6.4
Z_DIR
  Top 0.3: ARDUINO.8 99.75,36.26 100.75,37.26 100.75,42.45 101.62,43.32 STEPSTICK3.DIR
Z_MIN_PIN
  Top 0.3: J27.2 66.25,74.95 62,74.95 60.75,73.7 R27.1 | 60.54,73.76 R27.1 | ARDUINO.A11 53.57,75.88 55.75,73.7 R27.1
Z_MS1
  Top 0.3: J20.1 STEPSTICK3.MS1 110.78,57.48 R7.2
Z_MS2
  Top 0.3: J20.3 STEPSTICK3.MS2
Z_MS3
  Top 0.3: J20.5 STEPSTICK3.MS3
Z_STEP
  Bottom 0.3: STEPSTICK3.STEP 101.57,45.52 100.75,44.7 100.75,34.45 100,33.7 99.02,33.7 ARDUINO.9
Z_STOP  (via drill 0.5)
  Top 0.3: R27.2 J27.1 65.75,73.7 67,72.45 v85.25,72.45 | J9A.1 114.98,31.18 111,31.18 105.52,25.7 102.5,25.7 100.75,27.45 94.5,27.45 93.5,26.45 91.25,26.45 90.25,27.45 v86.25,27.45
  Top 1: J9A.1 122.05,27.13 J9.1
  Bottom 0.3: v86.25,27.45 86.75,27.95 86.75,59.7 84.75,61.7 84.75,71.95 v85.25,72.45

## Text on the board
Top: TOP
Bottom: BOT
tPlace: PS-ON | +12V | STDBY | GND | +5V | MOT | ENDSTOP | X AXIS | MODULAR TOOL #2 | SPARE I/O | Released under / CC-BY-SA 4.0 license / (http://goo.gl/B0gjwG) / Design by Neil Jansen | MODULAR TOOL #3 | MODULAR TOOL #1 | 21_SCL | 20_SDA | RX1 | JTAG | TCK | TX1 | GND | DATA | +5V | GND | MODULAR TOOL #4 | GND | TDO | IOREF | RX2 | !RST | P/N: EMC02 Rev B | MOSI | TMS | SCLK | !RST | TX2 | +5V | 5V I/O | RX3 | MISO | TDI | TX3 | SPI/ISCP | GND | 3.3V I/O | http://delta.firepick.org | FAN1 | RXD | TXD | FAN2 | ENDSTOP | MOT | VIN | GND | GND | Z AXIS | I2C | MOT | Y AXIS | +5V | SDA | 3.3V | SCL | !RESET | ENDSTOP | GND | IOREF | +5V | RESET | GND | RX | AREF | RXD | TX | SDA | +12V | +5V | +3.3V | GND | SCL | D13 | TEST POINTS | E-STOP